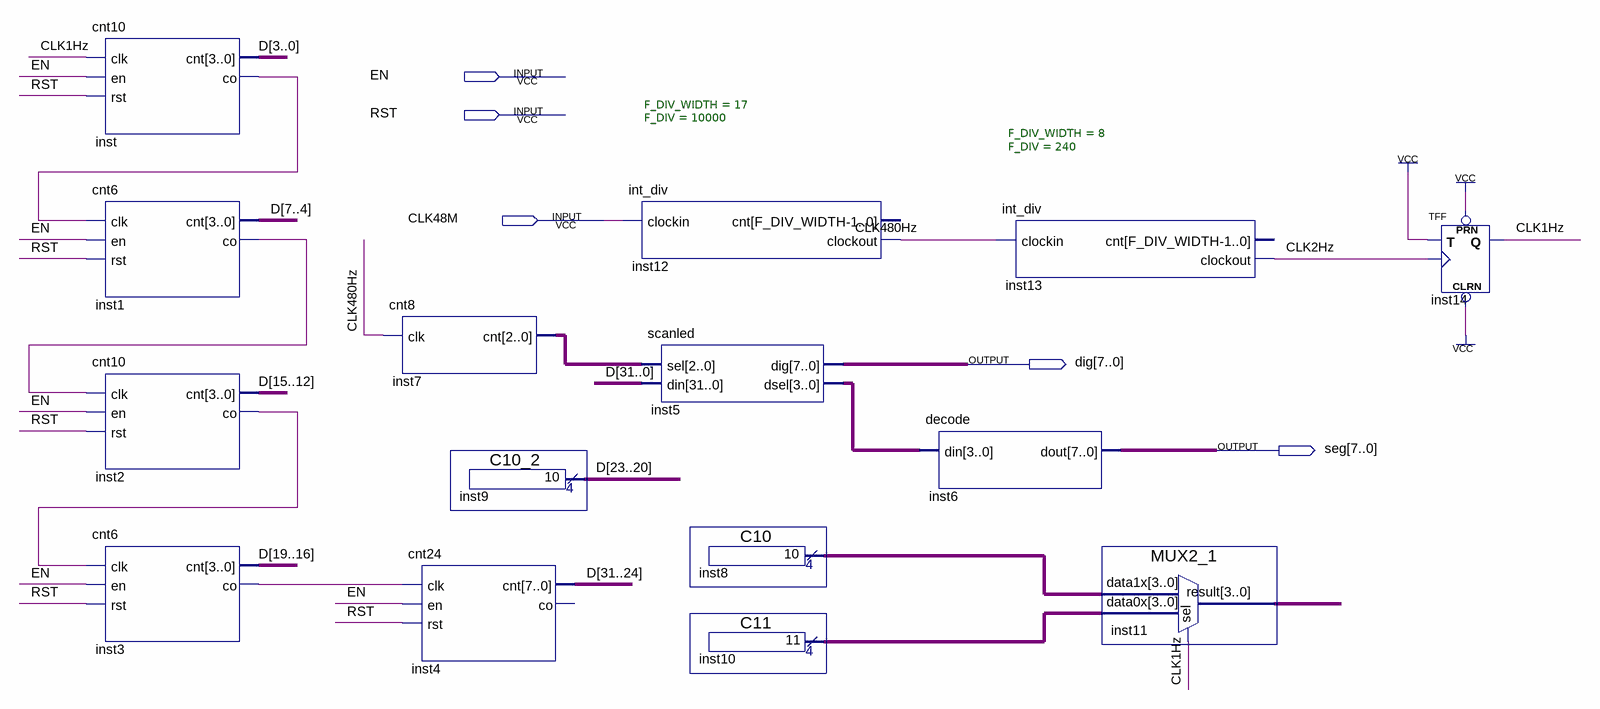
[diagram p0: schematic sheet]
// Quartus schematic clock.bdf as structural Verilog: 15 symbols, 5 pins
module clock (
  input  EN,
  input  RST,
  input  CLK48M,
  output [7:0] dig,
  output [7:0] seg
);

  wire CLK1Hz, CLK2Hz, CLK480Hz, inst1_co, inst2_co, inst3_co, inst_co;
  wire [2:0] inst7_cnt;
  wire [3:0] inst5_dsel, inst8_result, inst10_result, inst11_result;
  wire [31:0] D;

  cnt10 inst (.clk(CLK1Hz), .en(EN), .rst(RST), .cnt(D[3:0]), .co(inst_co));
  cnt6 inst1 (.clk(inst_co), .en(EN), .rst(RST), .cnt(D[7:4]), .co(inst1_co));
  cnt10 inst2 (.clk(inst1_co), .en(EN), .rst(RST), .cnt(D[15:12]), .co(inst2_co));
  cnt6 inst3 (.clk(inst2_co), .en(EN), .rst(RST), .cnt(D[19:16]), .co(inst3_co));
  cnt8 inst7 (.clk(CLK480Hz), .cnt(inst7_cnt));
  cnt24 inst4 (.clk(inst3_co), .en(EN), .rst(RST), .cnt(D[31:24]));  // open: co
  C10_2 inst9 (.result(D[23:20]));
  int_div #(.F_DIV_WIDTH(17), .F_DIV(10000)) inst12 (.clockin(CLK48M), .clockout(CLK480Hz));  // open: cnt
  scanled inst5 (.sel(inst7_cnt), .din(D), .dig(dig), .dsel(inst5_dsel));
  C10 inst8 (.result(inst8_result));
  C11 inst10 (.result(inst10_result));
  decode inst6 (.din(inst5_dsel), .dout(seg));
  int_div #(.F_DIV_WIDTH(8), .F_DIV(240)) inst13 (.clockin(CLK480Hz), .clockout(CLK2Hz));  // open: cnt
  MUX2_1 inst11 (.data1x(inst8_result), .data0x(inst10_result), .sel(CLK1Hz), .result(inst11_result));
  TFF inst14 (.PRN(1'b1), .CLRN(1'b1), .T(1'b1), .CLK(CLK2Hz), .Q(CLK1Hz));
endmodule
